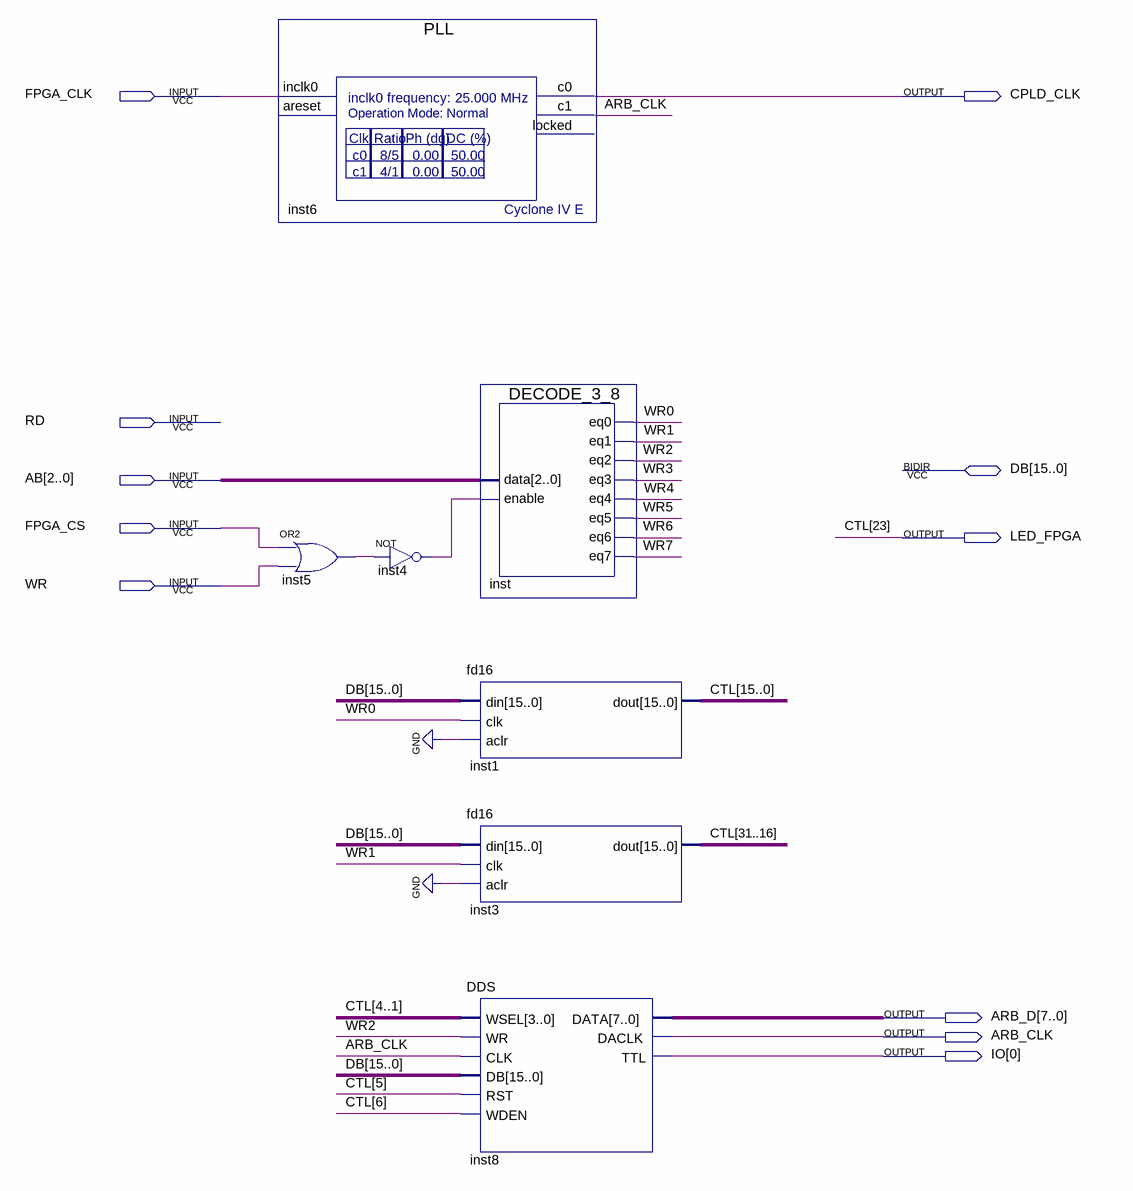
[diagram p0: schematic sheet]
// Quartus schematic arb.bdf as structural Verilog: 7 symbols, 11 pins
module arb (
  input  FPGA_CLK,
  input  RD,
  input  [2:0] AB,
  input  FPGA_CS,
  input  WR,
  inout  [15:0] DB,
  output CPLD_CLK,
  output LED_FPGA,
  output [7:0] ARB_D,
  output ARB_CLK,
  output [0:0] IO
);

  wire inst4_out, inst5_out, WR0, WR1, WR2, WR3, WR4, WR5, WR6, WR7;
  wire [31:0] CTL;

  PLL inst6 (.inclk0(FPGA_CLK), .c0(CPLD_CLK), .c1(ARB_CLK));  // open: areset, locked
  or inst5 (inst5_out, FPGA_CS, WR);
  not inst4 (inst4_out, inst5_out);
  DECODE_3_8 inst (
    .data(AB), .enable(inst4_out), .eq0(WR0), .eq1(WR1), .eq2(WR2), .eq3(WR3), .eq4(WR4), .eq5(WR5),
    .eq6(WR6), .eq7(WR7));
  fd16 inst1 (.din(DB), .clk(WR0), .aclr(1'b0), .dout(CTL[15:0]));
  fd16 inst3 (.din(DB), .clk(WR1), .aclr(1'b0), .dout({CTL[31:24], LED_FPGA, CTL[22:16]}));
  DDS inst8 (
    .WSEL(CTL[4:1]), .WR(WR2), .CLK(ARB_CLK), .DB(DB), .RST(CTL[5]), .WDEN(CTL[6]), .DATA(ARB_D),
    .DACLK(ARB_CLK), .TTL(IO[0]));

  // Other names for the same wires on the sheet: CTL[23] = LED_FPGA
endmodule
